# Altium project 555_timer.PrjPcb
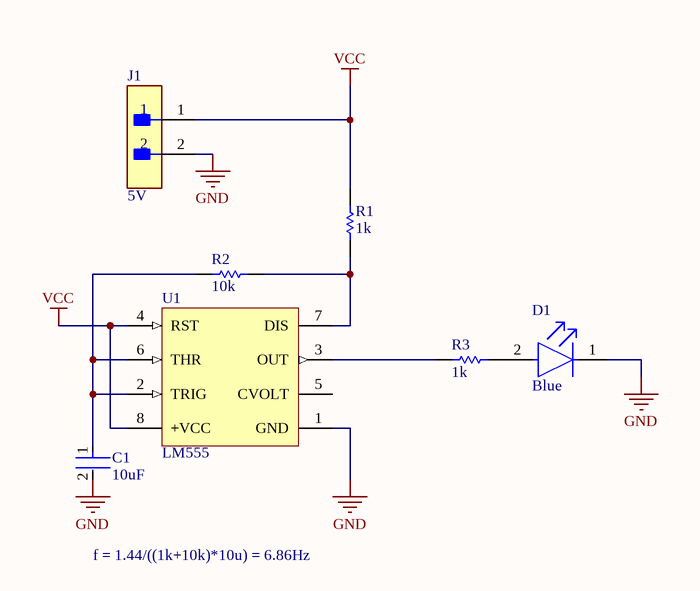
[diagram p0: 555_timer.SchDoc]
1 sheet, 7 parts. Net scope: global (net labels, ports and power ports of the same name join across sheets).
Board file: 555_timer.PcbDoc

## Sheet 555_timer.SchDoc
size A4; SheetNumber: 1; SheetTotal: 1

### Parts
C1  10uF  [FP-C0805C-DN-IPC_A]
D1  Blue  [FP-C0805C-DN-IPC_A]
J1  5V  [FP-B2B-EH-A_LF_SN-MFG]
R1  1k  [FP-C0805C-DN-IPC_A]
R2  10k  [FP-C0805C-DN-IPC_A]
R3  1k  [FP-C0805C-DN-IPC_A]
U1  LM555  [N08E]

### Nets
GND: C1.2 D1.1(C) J1.2 U1.1(GND)
VCC: J1.1 R1.2 U1.4(RST) U1.8(+VCC)
NetC1_1: C1.1 R2.1 U1.2(TRIG) U1.6(THR)
NetD1_2: D1.2(A) R3.2
NetR1_1: R1.1 R2.2 U1.7(DIS)
NetR3_1: R3.1 U1.3(OUT)

Not connected (* = marked no-connect by the designer): U1 5(CVOLT)

### Notes on the sheet
- f = 1.44/((1k+10k)*10u) = 6.86Hz

### Library data of the parts
C1 = GRM21BR61C106KE15L: 贴片电容（MLCC） 10μF ±10% 16V X5R 0805; Manufacturer: Murata; Material: Ceramic; Supplier 1: Digi-Key; Manufacturer Part Number: GRM21BR61C106KE15L; RoHS: Yes; Category: Ceramic Capacitors; Pricing 1: 1=0.18000, 10=0.12400, 50=0.07420, 100=0.06270, 500=0.04292, 1000=0.03798 (USD); Mount: Surface Mount; Case/Package: 0805; Case Code (Imperial): 0805; Case Code (Metric): 2012; Min Operating Temperature: -55°C; Max Operating Temperature: 85°C; Packaging: Tape and Reel; Capacitance: 10uF; Tolerance: 10%; Voltage Rating: 16V; Voltage Rating (DC): 16V; Package Quantity: 1; Dielectric: X5R; Termination: SMD/SMT; Voltage: 16V; Series: GRM; Construction: Flat; Length: 2mm; Width: 1.25mm; Height: 1.25mm; Thickness: 0.053inch; Depth: 1.25mm; Radiation Hardening: No; REACH SVHC: No SVHC; RoHS Compliant: Yes; Lead Free: Lead Free; ComponentLink1URL: https://datasheet.ciiva.com/7719/1747468-7719090.pdf?src-supplier=Element14; ComponentLink1Description: https://datasheet.ciiva.com/7719/1747468-7719090.pdf?src-supplier=Element14; ComponentLink2URL: https://datasheet.ciiva.com/23628/460993-23628598.pdf?src-supplier=Newark; ComponentLink2Description: https://datasheet.ciiva.com/23628/460993-23628598.pdf?src-supplier=Newark; ComponentLink3URL: https://datasheet.ciiva.com/2989/product-2989696.pdf?src-supplier=Avnet; ComponentLink3Description: https://datasheet.ciiva.com/2989/product-2989696.pdf?src-supplier=Avnet; ComponentLink4URL: https://datasheet.ciiva.com/3777/1956grm21br61c106ke1523-3777137.pdf?src-supplier=Arrow+Electronics; ComponentLink4Description: https://datasheet.ciiva.com/3777/1956grm21br61c106ke1523-3777137.pdf?src-supplier=Arrow+Electronics; ComponentLink5URL: https://datasheet.ciiva.com/29202/450891-da-01-de-vs-chip-kond-0805-10-0-uf-10pr-16-0v-x5r-29202696.pdf?src-supplier=Conrad; ComponentLink5Description: https://datasheet.ciiva.com/29202/450891-da-01-de-vs-chip-kond-0805-10-0-uf-10pr-16-0v-x5r-29202696.pdf?src-supplier=Conrad; ComponentLink6URL: https://datasheet.ciiva.com/29199/454607-da-01-en-vs-kondensator-0805-29199611.pdf?src-supplier=Conrad; ComponentLink6Description: https://datasheet.ciiva.com/29199/454607-da-01-en-vs-kondensator-0805-29199611.pdf?src-supplier=Conrad; ComponentLink7URL: https://datasheet.ciiva.com/137/partnumbering-e-01-137918.pdf?src-supplier=Digi-Key; ComponentLink7Description: https://datasheet.ciiva.com/137/partnumbering-e-01-137918.pdf?src-supplier=Digi-Key; ComponentLink8URL: https://datasheet.ciiva.com/137/partnumbering-e-01-137917.pdf?src-supplier=Digi-Key; ComponentLink8Description: https://datasheet.ciiva.com/137/partnumbering-e-01-137917.pdf?src-supplier=Digi-Key; ComponentLink9URL: https://datasheet.ciiva.com/137/partnumbering-e-01-137919.pdf?src-supplier=Digi-Key; ComponentLink9Description: https://datasheet.ciiva.com/137/partnumbering-e-01-137919.pdf?src-supplier=Digi-Key; ComponentLink10URL: https://datasheet.ciiva.com/2989/product-2989697.pdf?src-supplier=Avnet; ComponentLink10Description: https://datasheet.ciiva.com/2989/product-2989697.pdf?src-supplier=Avnet; Supplier Part Number 1: 490-3886-1-ND; Stock 1: 9508002
D1 = LTST-C170TBKT: LED BLUE CLEAR 0805 SMD; Manufacturer: Vishay Lite-On; Lens Color: Colorless; Viewing Angle: 130°; Luminous Intensity: 180mcd; Forward Current: 20mA; Forward Voltage: 3.8V; Lens Style: Diffused,Colorless,Clear,Rectangular; Dominant Wavelength: 475nm; Wavelength: 468nm; Number of LEDs: 1; Power Rating: 76mW; Reverse Voltage: 5V; Supplier 1: Digi-Key; Manufacturer Part Number: LTST-C170TBKT; RoHS: Yes; Category: LEDs; Stock 1: 153274; Pricing 1: 1=0.36000, 10=0.23900, 100=0.15930, 500=0.11016, 1000=0.09180 (USD); Mount: Surface Mount; Case/Package: 0805; Number of Pins: 2; Color: Blue; Case Code (Metric): 2012; Case Code (Imperial): 0805; Min Operating Temperature: -20°C; Max Operating Temperature: 80°C; Packaging: Tape and Reel; Package Quantity: 1; Test Current: 20mA; Illumination Color: Blue; Series: -; Lens Transparency: Clear; Number of Elements: 1; Power Dissipation: 76mW; Length: 2mm; Width: 1.25mm; Height: 1.1mm; Depth: 1.25mm; Radiation Hardening: No; RoHS Compliant: Yes; Lead Free: Lead Free; ComponentLink1URL: https://datasheet.ciiva.com/27055/1996161-27055955.pdf?src-supplier=Jameco; ComponentLink1Description: https://datasheet.ciiva.com/27055/1996161-27055955.pdf?src-supplier=Jameco; ComponentLink2URL: https://datasheet.ciiva.com/11773/0900766b80dc0281-11773879.pdf?src-supplier=RSComponents; ComponentLink2Description: https://datasheet.ciiva.com/11773/0900766b80dc0281-11773879.pdf?src-supplier=RSComponents; ComponentLink3URL: https://datasheet.ciiva.com/12400/lite-on-ltst-c170tbkt-190169-12400787.pdf?src-supplier=Mouser; ComponentLink3Description: https://datasheet.ciiva.com/12400/lite-on-ltst-c170tbkt-190169-12400787.pdf?src-supplier=Mouser; ComponentLink4URL: https://datasheet.ciiva.com/16199/lite-on20ltst-c170tbkt-16199611.pdf?src-supplier=Future+Electronics; ComponentLink4Description: https://datasheet.ciiva.com/16199/lite-on20ltst-c170tbkt-16199611.pdf?src-supplier=Future+Electronics; ComponentLink5URL: https://datasheet.ciiva.com/15117/getdatasheetpartid-103986-15117447.pdf?src-supplier=Verical; ComponentLink5Description: https://datasheet.ciiva.com/15117/getdatasheetpartid-103986-15117447.pdf?src-supplier=Verical; ComponentLink6URL: https://datasheet.ciiva.com/25764/ltst-c170tbkt-25764828.pdf?src-supplier=Allied+Electronics; ComponentLink6Description: https://datasheet.ciiva.com/25764/ltst-c170tbkt-25764828.pdf?src-supplier=Allied+Electronics; ComponentLink7URL: https://datasheet.ciiva.com/2110/s-110-ltst-c170tbkt-2110489.pdf?src-supplier=Digi-Key; ComponentLink7Description: https://datasheet.ciiva.com/2110/s-110-ltst-c170tbkt-2110489.pdf?src-supplier=Digi-Key; ComponentLink8URL: https://datasheet.ciiva.com/2110/s-110-ltst-c170tbkt-2110488.pdf?src-supplier=Digi-Key; ComponentLink8Description: https://datasheet.ciiva.com/2110/s-110-ltst-c170tbkt-2110488.pdf?src-supplier=Digi-Key; ComponentLink9URL: https://datasheet.ciiva.com/2110/s-110-ltst-c170tbkt-2110490.pdf?src-supplier=Digi-Key; ComponentLink9Description: https://datasheet.ciiva.com/2110/s-110-ltst-c170tbkt-2110490.pdf?src-supplier=Digi-Key; Supplier Part Number 1: 160-1579-1-ND
J1 = B2B-EH-A(LF)(SN): CONN HEADER EH TOP 2POS 2.5MM; Manufacturer: JST; Number of Positions: 2; Connector Type: Plug; Current Rating: 3A; Max Voltage Rating (AC): 250V; Gender: Male; Contact Resistance: 20mR; Supplier 1: Digi-Key; Manufacturer Part Number: B2B-EH-A(LF)(SN); RoHS: Yes; Category: Headers and Wire Housings; Pricing 1: 1=0.14000, 10=0.11000, 100=0.08090, 500=0.06698, 1000=0.05861, 5000=0.05024, 10000=0.04884 (USD); Mount: Through Hole; Color: Natural; Housing Color: White; Housing Material: Nylon; Contact Material: Copper Alloy,Brass; Contact Plating: Tin,Copper; Min Operating Temperature: -25°C; Max Operating Temperature: 85°C; Number of Rows: 1; Packaging: Bulk; Termination: Press-Fit; Number of Contacts: 2; Orientation: Straight; Series: EH; Contact Type: Male Pin; Max Current Rating: 3A; Fastening Type: Detent; Voltage Rating: 250V; Length: 7.5mm; Pitch: 2.5mm; Depth: 3.8mm; Contact Mating Length: 0.13inch; Lead Free: Lead Free; ComponentLink1URL: https://datasheet.ciiva.com/26924/getdatasheetpartid-639961-26924027.pdf?src-supplier=Verical; ComponentLink1Description: https://datasheet.ciiva.com/26924/getdatasheetpartid-639961-26924027.pdf?src-supplier=Verical; ComponentLink2URL: https://datasheet.ciiva.com/11746/0900766b805aab1f-11746167.pdf?src-supplier=RSComponents; ComponentLink2Description: https://datasheet.ciiva.com/11746/0900766b805aab1f-11746167.pdf?src-supplier=RSComponents; ComponentLink3URL: https://datasheet.ciiva.com/41451/001217319-da-01-en-stiftleiste-gerade-2-pol-rm-25mm-41451366.pdf?src-supplier=Conrad; ComponentLink3Description: https://datasheet.ciiva.com/41451/001217319-da-01-en-stiftleiste-gerade-2-pol-rm-25mm-41451366.pdf?src-supplier=Conrad; ComponentLink4URL: https://datasheet.ciiva.com/16449/b2b-eh-alfsn-16449468.pdf?src-supplier=Future+Electronics; ComponentLink4Description: https://datasheet.ciiva.com/16449/b2b-eh-alfsn-16449468.pdf?src-supplier=Future+Electronics; ComponentLink5URL: https://datasheet.ciiva.com/712/eeh-712441.pdf?src-supplier=Digi-Key; ComponentLink5Description: https://datasheet.ciiva.com/712/eeh-712441.pdf?src-supplier=Digi-Key; Supplier Part Number 1: 455-1611-ND
R1 R3 = CRCW08051K00FKEA: Res Thick Film 0805 1K Ohm 1% 1/8W ±100ppm/°C Molded SMD Paper T/R; Manufacturer: Vishay Dale; Voltage Rating: 150V; Power Rating: 125mW; Resistance: 1kR; Supplier 1: Digi-Key; Manufacturer Part Number: CRCW08051K00FKEA; RoHS: Yes; Category: Chip SMD Resistors; Stock 1: 6505; Pricing 1: 1=0.10000, 10=0.06700, 100=0.02710, 1000=0.01219, 2500=0.01058 (USD); Case/Package: 0805; Number of Pins: 2; Case Code (Imperial): 0805; Case Code (Metric): 2012; Contact Plating: Tin; Size Code: 0805; Weight: 0.000194oz; Min Operating Temperature: -55°C; Max Operating Temperature: 155°C; Packaging: Tape and Reel; Tolerance: 1%; Resistor Type: Thick Film; Termination: SMD/SMT; Temperature Coefficient: 100ppm/°C; Series: CRCW; Max Power Dissipation: 125mW; Number of Terminations: 2; Resistance Tolerance: 1%; Package Quantity: 5000; Voltage Rating (DC): 150V; Construction: Rectangular; Features: Automotive AEC-Q200; Technology: THICK FILM; Length: 2mm; Width: 1.25mm; Height: 0.45mm; Depth: 1.25mm; Radiation Hardening: No; REACH SVHC: Unknown; RoHS Compliant: Yes; Military Standard: Not; Lead Free: Lead Free; ComponentLink1URL: https://datasheet.ciiva.com/11808/0900766b80d98b26-11808530.pdf?src-supplier=RSComponents; ComponentLink1Description: https://datasheet.ciiva.com/11808/0900766b80d98b26-11808530.pdf?src-supplier=RSComponents; ComponentLink2URL: https://datasheet.ciiva.com/3258/dcrcwe3-3258215.pdf?src-supplier=Avnet; ComponentLink2Description: https://datasheet.ciiva.com/3258/dcrcwe3-3258215.pdf?src-supplier=Avnet; ComponentLink3URL: https://datasheet.ciiva.com/26312/fld-crcw-e3-data-en-26312922.pdf?src-supplier=Distrelec; ComponentLink3Description: https://datasheet.ciiva.com/26312/fld-crcw-e3-data-en-26312922.pdf?src-supplier=Distrelec; ComponentLink4URL: https://datasheet.ciiva.com/16213/dcrcwe3-16213643.pdf?src-supplier=Future+Electronics; ComponentLink4Description: https://datasheet.ciiva.com/16213/dcrcwe3-16213643.pdf?src-supplier=Future+Electronics; ComponentLink5URL: https://datasheet.ciiva.com/46381/1697337-46381606.pdf?src-supplier=Element14; ComponentLink5Description: https://datasheet.ciiva.com/46381/1697337-46381606.pdf?src-supplier=Element14; ComponentLink6URL: https://datasheet.ciiva.com/46441/1720486-46441626.pdf?src-supplier=Element14; ComponentLink6Description: https://datasheet.ciiva.com/46441/1720486-46441626.pdf?src-supplier=Element14; Supplier Part Number 1: 541-1.00KCDKR-ND
R2 = CRCW080510K0FKEA: Res Thick Film 0805 10K Ohm 1% 1/8W ±100ppm/°C Molded SMD Paper T/R; Manufacturer: Vishay; Resistance: 10kR; Power Rating: 125mW; Voltage Rating: 150V; Supplier 1: Digi-Key; Manufacturer Part Number: CRCW080510K0FKEA; RoHS: Yes; Category: Chip SMD Resistors; Pricing 1: 1=0.10000, 10=0.06700, 100=0.02710, 1000=0.01219, 2500=0.01058 (USD); Case/Package: 0805; Case Code (Imperial): 0805; Case Code (Metric): 2012; Contact Plating: Tin; Size Code: 0805; Weight: 0.000194oz; Min Operating Temperature: -55°C; Max Operating Temperature: 155°C; Tolerance: 1%; Packaging: Tape and Reel; Resistor Type: Thick Film; Temperature Coefficient: 100ppm/°C; Termination: SMD/SMT; Series: CRCW; Max Power Dissipation: 125mW; Number of Terminations: 2; Resistance Tolerance: 1%; Voltage Rating (DC): 150V; Package Quantity: 5000; Technology: THICK FILM; Features: Automotive AEC-Q200; Construction: Rectangular; Length: 2mm; Width: 1.25mm; Height: 0.45mm; Depth: 1.25mm; Radiation Hardening: No; RoHS Compliant: Yes; REACH SVHC: Unknown; Military Standard: Not; Lead Free: Lead Free; ComponentLink1URL: https://datasheet.ciiva.com/11808/0900766b80d98b26-11808216.pdf?src-supplier=RSComponents; ComponentLink1Description: https://datasheet.ciiva.com/11808/0900766b80d98b26-11808216.pdf?src-supplier=RSComponents; ComponentLink2URL: https://datasheet.ciiva.com/46394/1720486-46394381.pdf?src-supplier=Element14; ComponentLink2Description: https://datasheet.ciiva.com/46394/1720486-46394381.pdf?src-supplier=Element14; ComponentLink3URL: https://datasheet.ciiva.com/16719/70201119-16719082.pdf?src-supplier=Allied+Electronics; ComponentLink3Description: https://datasheet.ciiva.com/16719/70201119-16719082.pdf?src-supplier=Allied+Electronics; ComponentLink4URL: https://datasheet.ciiva.com/16755/70201119-16755389.pdf?src-supplier=Allied+Electronics; ComponentLink4Description: https://datasheet.ciiva.com/16755/70201119-16755389.pdf?src-supplier=Allied+Electronics; ComponentLink5URL: https://datasheet.ciiva.com/5547/dcrcwe3-109170-5547559.pdf?src-supplier=Mouser; ComponentLink5Description: https://datasheet.ciiva.com/5547/dcrcwe3-109170-5547559.pdf?src-supplier=Mouser; ComponentLink6URL: https://datasheet.ciiva.com/8337/dcrcwe3-8337773.pdf?src-supplier=Avnet; ComponentLink6Description: https://datasheet.ciiva.com/8337/dcrcwe3-8337773.pdf?src-supplier=Avnet; ComponentLink7URL: https://datasheet.ciiva.com/16199/dcrcwe3-16199086.pdf?src-supplier=Future+Electronics; ComponentLink7Description: https://datasheet.ciiva.com/16199/dcrcwe3-16199086.pdf?src-supplier=Future+Electronics; ComponentLink8URL: https://datasheet.ciiva.com/8337/dcrcwe3-8337774.pdf?src-supplier=Avnet; ComponentLink8Description: https://datasheet.ciiva.com/8337/dcrcwe3-8337774.pdf?src-supplier=Avnet; Supplier Part Number 1: 541-10.0KCDKR-ND
U1 = LM555CN: LM555 Series 16 V 7.5 mA Monolithic General Purpose Single Timer - DIP-8; Manufacturer: TI National Semiconductor; Frequency: 100kHz; Low Level Output Current: 200mA; High Level Output Current: -200mA; Min Supply Voltage: 4.5V; Max Supply Voltage: 16V; Number of Timers/Counters: 1; Quiescent Current: 3mA; Operating Supply Current: 10mA; Max Power Dissipation: 1.18W; Current Rating: 15A; Supplier 1: Digi-Key; Manufacturer Part Number: LM555CN; RoHS: No; Category: Timers and Oscillators; Mount: Through Hole; Case/Package: PDIP; Number of Pins: 8; Min Operating Temperature: 0°C; Max Operating Temperature: 70°C; Packaging: Rail/Tube; Package Quantity: 40; Nominal Supply Current: 3mA; Power Dissipation: 1.18W; Series: LM555; Supply Current: 3mA; Number of Channels: 1; Output Current: 200mA; Radiation Hardening: No; Lead Free: Lead Free; RoHS Compliant: No; REACH SVHC: No SVHC; ComponentLink1URL: https://datasheet.ciiva.com/1139/55410-1139386.pdf?src-supplier=Element14; ComponentLink1Description: https://datasheet.ciiva.com/1139/55410-1139386.pdf?src-supplier=Element14; ComponentLink2URL: https://datasheet.ciiva.com/14274/lm555-14274455.pdf?src-supplier=Avnet; ComponentLink2Description: https://datasheet.ciiva.com/14274/lm555-14274455.pdf?src-supplier=Avnet; ComponentLink3URL: https://datasheet.ciiva.com/15152/getdatasheetpartid-647179-15152582.pdf?src-supplier=Verical; ComponentLink3Description: https://datasheet.ciiva.com/15152/getdatasheetpartid-647179-15152582.pdf?src-supplier=Verical; ComponentLink4URL: https://datasheet.ciiva.com/6667/lm555-6667629.pdf?src-supplier=Digi-Key; ComponentLink4Description: https://datasheet.ciiva.com/6667/lm555-6667629.pdf?src-supplier=Digi-Key; Supplier Part Number 1: LM555CN-ND